# Altium schematic sheet 03-MEMORY.SchDoc
size A3
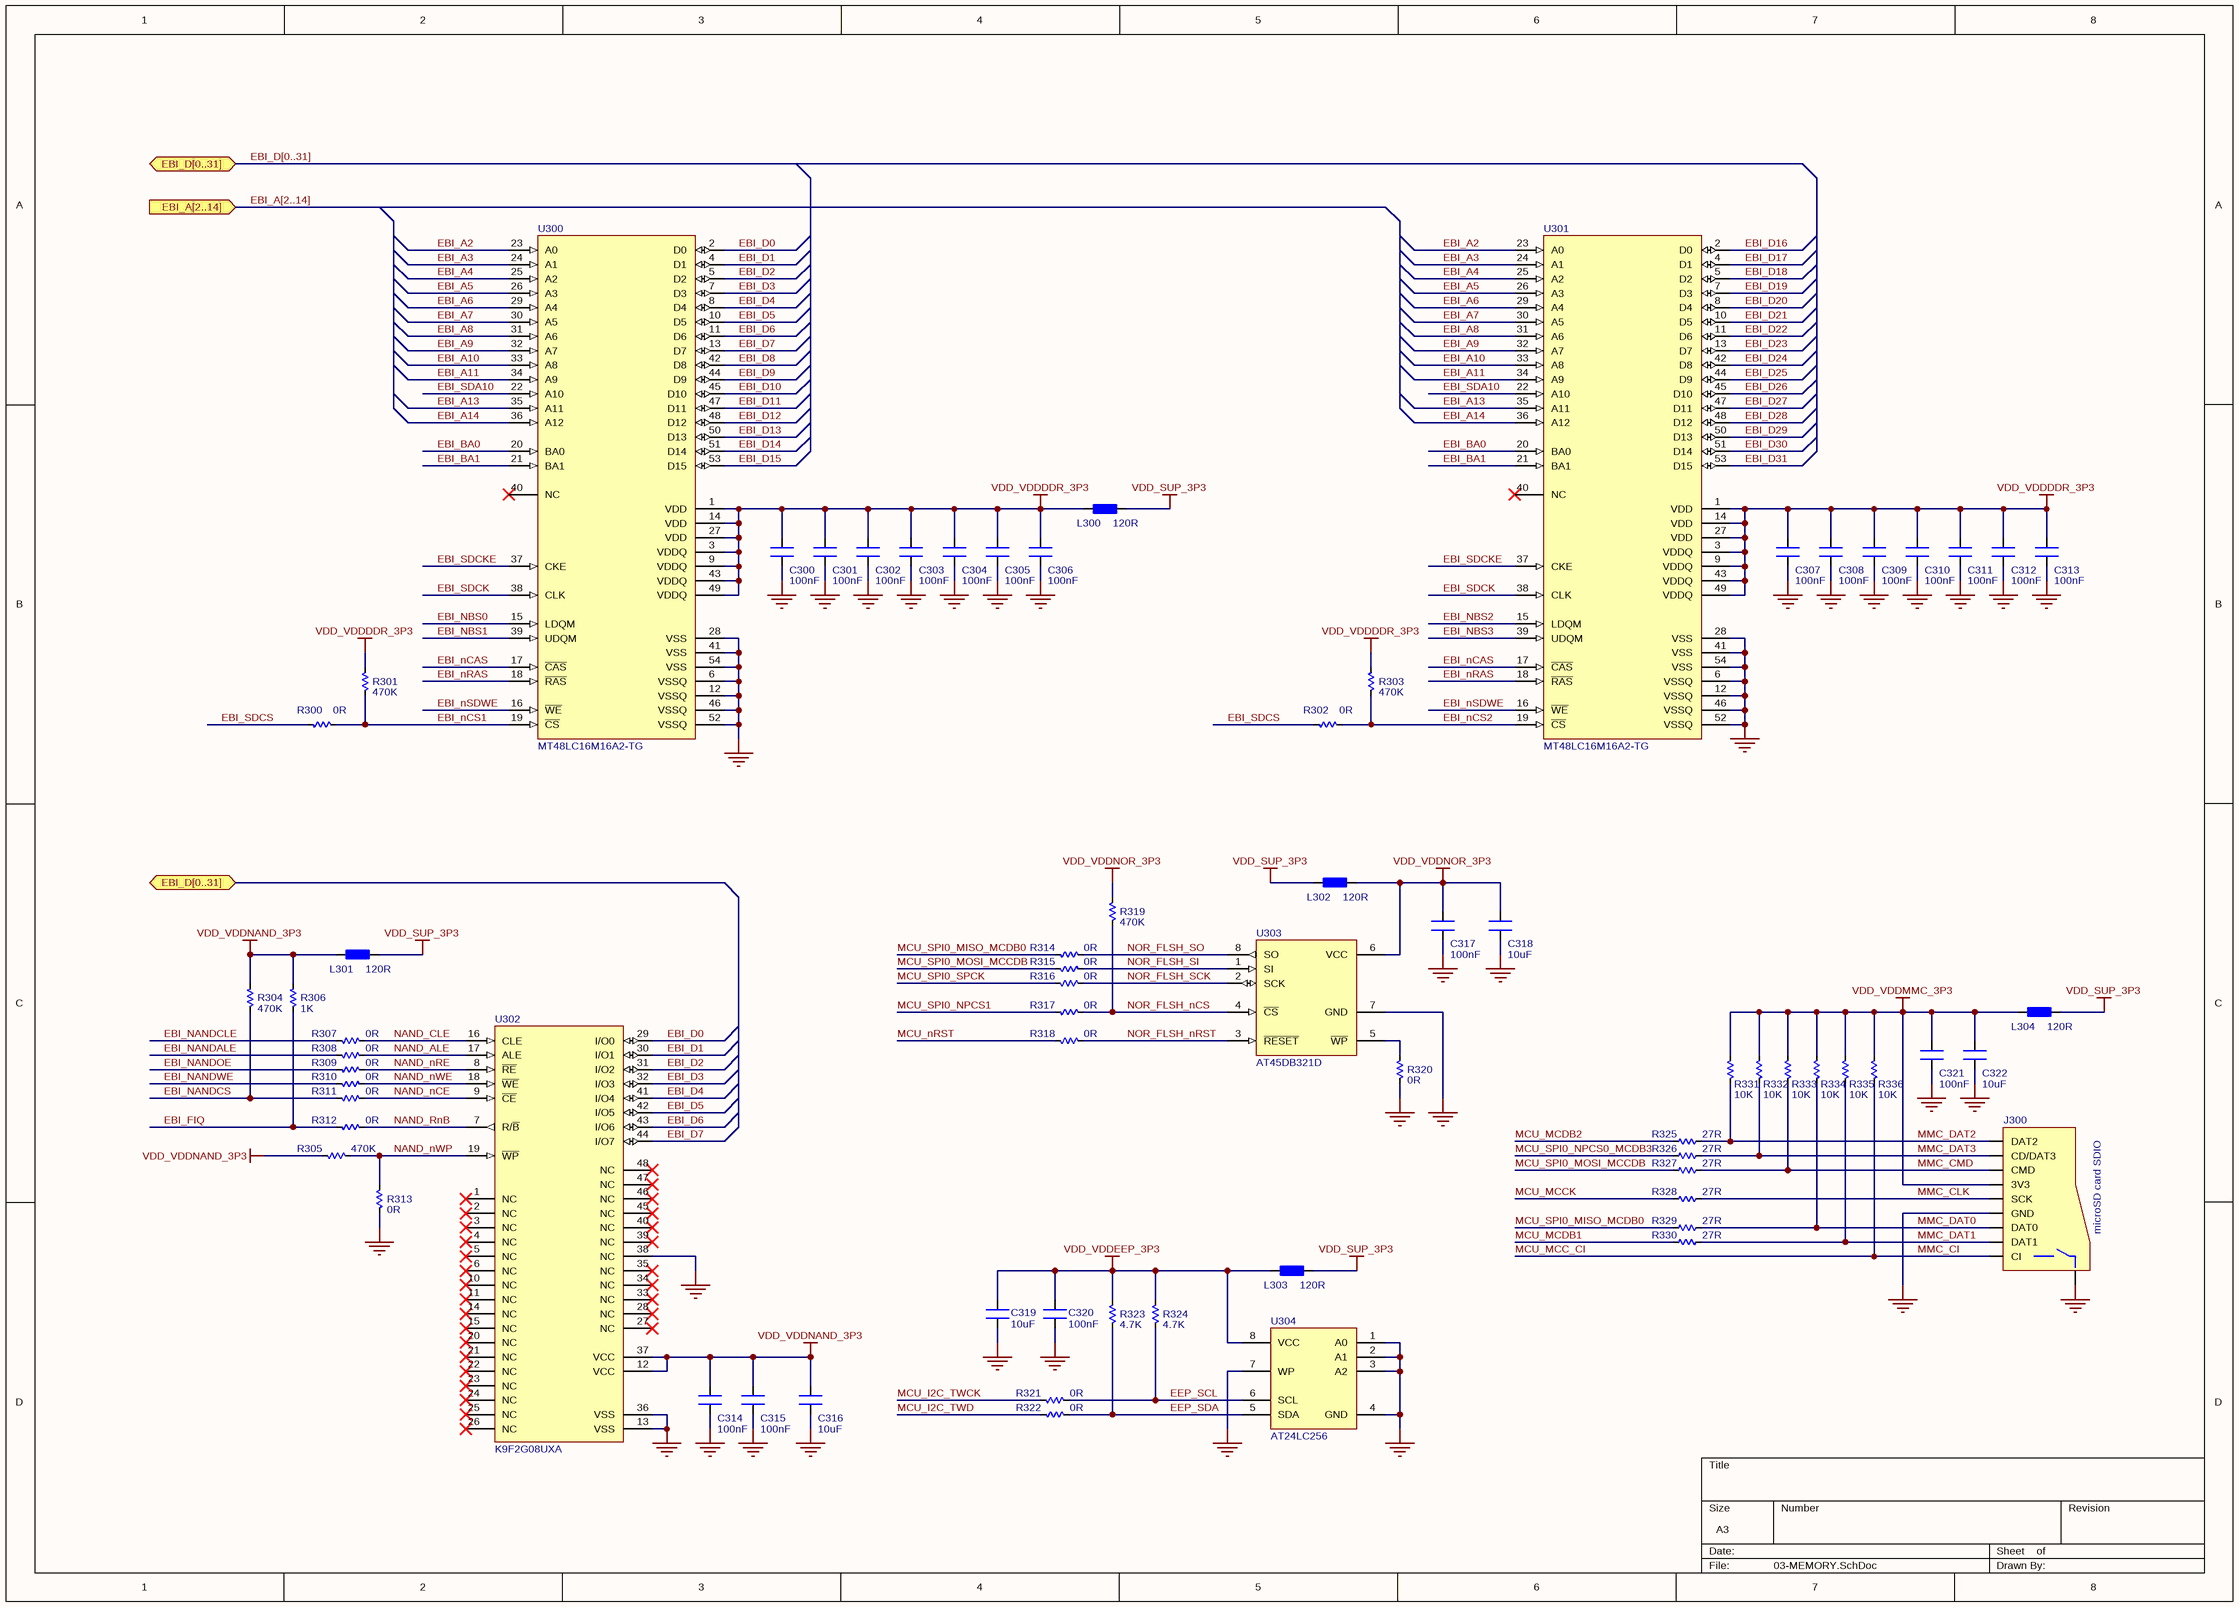
[diagram p0: 03-MEMORY.SchDoc]

## Parts
C300  value 100nF  [CN-SMD-0603]  (hidden comment: Capacitor)
C301  value 100nF  [CN-SMD-0603]  (hidden comment: Capacitor)
C302  value 100nF  [CN-SMD-0603]  (hidden comment: Capacitor)
C303  value 100nF  [CN-SMD-0603]  (hidden comment: Capacitor)
C304  value 100nF  [CN-SMD-0603]  (hidden comment: Capacitor)
C305  value 100nF  [CN-SMD-0603]  (hidden comment: Capacitor)
C306  value 100nF  [CN-SMD-0603]  (hidden comment: Capacitor)
C307  value 100nF  [CN-SMD-0603]  (hidden comment: Capacitor)
C308  value 100nF  [CN-SMD-0603]  (hidden comment: Capacitor)
C309  value 100nF  [CN-SMD-0603]  (hidden comment: Capacitor)
C310  value 100nF  [CN-SMD-0603]  (hidden comment: Capacitor)
C311  value 100nF  [CN-SMD-0603]  (hidden comment: Capacitor)
C312  value 100nF  [CN-SMD-0603]  (hidden comment: Capacitor)
C313  value 100nF  [CN-SMD-0603]  (hidden comment: Capacitor)
C314  value 100nF  [CN-SMD-0603]  (hidden comment: Capacitor)
C315  value 100nF  [CN-SMD-0603]  (hidden comment: Capacitor)
C316  value 10uF  [CN-SMD-0603]  (hidden comment: Capacitor)
C317  value 100nF  [CN-SMD-0603]  (hidden comment: Capacitor)
C318  value 10uF  [CN-SMD-0603]  (hidden comment: Capacitor)
C319  value 10uF  [CN-SMD-0603]  (hidden comment: Capacitor)
C320  value 100nF  [CN-SMD-0603]  (hidden comment: Capacitor)
C321  value 100nF  [CN-SMD-0603]  (hidden comment: Capacitor)
C322  value 10uF  [CN-SMD-0603]  (hidden comment: Capacitor)
J300  microSD card SDIO  [MICROSD1]
L300  value 120R  [L-SMD-0603]  (hidden comment: Ferrite bead)
L301  value 120R  [L-SMD-0603]  (hidden comment: Ferrite bead)
L302  value 120R  [L-SMD-0603]  (hidden comment: Ferrite bead)
L303  value 120R  [L-SMD-0603]  (hidden comment: Ferrite bead)
L304  value 120R  [L-SMD-0603]  (hidden comment: Ferrite bead)
R300  value 0R  [RES-SMD-0603]  (hidden comment: Resistor)
R301  value 470K  [RES-SMD-0603]  (hidden comment: Resistor)
R302  value 0R  [RES-SMD-0603]  (hidden comment: Resistor)
R303  value 470K  [RES-SMD-0603]  (hidden comment: Resistor)
R304  value 470K  [RES-SMD-0603]  (hidden comment: Resistor)
R305  value 470K  [RES-SMD-0603]  (hidden comment: Resistor)
R306  value 1K  [RES-SMD-0603]  (hidden comment: Resistor)
R307  value 0R  [RES-SMD-0603]  (hidden comment: Resistor)
R308  value 0R  [RES-SMD-0603]  (hidden comment: Resistor)
R309  value 0R  [RES-SMD-0603]  (hidden comment: Resistor)
R310  value 0R  [RES-SMD-0603]  (hidden comment: Resistor)
R311  value 0R  [RES-SMD-0603]  (hidden comment: Resistor)
R312  value 0R  [RES-SMD-0603]  (hidden comment: Resistor)
R313  value 0R  [RES-SMD-0603]  (hidden comment: Resistor)
R314  value 0R  [RES-SMD-0603]  (hidden comment: Resistor)
R315  value 0R  [RES-SMD-0603]  (hidden comment: Resistor)
R316  value 0R  [RES-SMD-0603]  (hidden comment: Resistor)
R317  value 0R  [RES-SMD-0603]  (hidden comment: Resistor)
R318  value 0R  [RES-SMD-0603]  (hidden comment: Resistor)
R319  value 470K  [RES-SMD-0603]  (hidden comment: Resistor)
R320  value 0R  [RES-SMD-0603]  (hidden comment: Resistor)
R321  value 0R  [RES-SMD-0603]  (hidden comment: Resistor)
R322  value 0R  [RES-SMD-0603]  (hidden comment: Resistor)
R323  value 4.7K  [RES-SMD-0603]  (hidden comment: Resistor)
R324  value 4.7K  [RES-SMD-0603]  (hidden comment: Resistor)
R325  27R  [RES-SMD-0603]
R326  27R  [RES-SMD-0603]
R327  27R  [RES-SMD-0603]
R328  27R  [RES-SMD-0603]
R329  27R  [RES-SMD-0603]
R330  27R  [RES-SMD-0603]
R331  value 10K  [RES-SMD-0603]  (hidden comment: Resistor)
R332  value 10K  [RES-SMD-0603]  (hidden comment: Resistor)
R333  value 10K  [RES-SMD-0603]  (hidden comment: Resistor)
R334  value 10K  [RES-SMD-0603]  (hidden comment: Resistor)
R335  value 10K  [RES-SMD-0603]  (hidden comment: Resistor)
R336  value 10K  [RES-SMD-0603]  (hidden comment: Resistor)
U300  MT48LC16M16A2-TG  [TSOP80P1180X120-54N]
U301  MT48LC16M16A2-TG  [TSOP80P1180X120-54N]
U302  K9F2G08UXA  [TSOP50P2000X120-48N]
U303  AT45DB321D  [SOIC127P798X216-8N]
U304  AT24LC256  [SOIC127P600X175-8N]

## Ports
EBI_A[2..14] (in), EBI_D[0..31] (bidir)

## Nets
GND: C300.1 C301.1 C302.1 C303.1 C304.1 C305.1 C306.1 C307.1 C308.1 C309.1 C310.1 C311.1 C312.1 C313.1 C314.1 C315.1 C316.1 C317.1 C318.1 C319.1 C320.1 C321.1 C322.1 J300.6(GND) J300.?1(NC) R313.2 R320.2 U300.6(VSSQ) U300.12(VSSQ) U300.28(VSS) U300.41(VSS) U300.46(VSSQ) U300.52(VSSQ) U300.54(VSS) U301.6(VSSQ) U301.12(VSSQ) U301.28(VSS) U301.41(VSS) U301.46(VSSQ) U301.52(VSSQ) U301.54(VSS) U302.13(VSS) U302.36(VSS) U302.38(NC) U303.7(GND) U304.1(A0) U304.2(A1) U304.3(A2) U304.4(GND) U304.7(WP)
VDD_SUP_3P3: L300.2 L301.2 L302.2 L303.2 L304.2
VDD_VDDDDR_3P3: C300.2 C301.2 C302.2 C303.2 C304.2 C305.2 C306.2 C307.2 C308.2 C309.2 C310.2 C311.2 C312.2 C313.2 L300.1 R301.1 R303.1 U300.1(VDD) U300.3(VDDQ) U300.9(VDDQ) U300.14(VDD) U300.27(VDD) U300.43(VDDQ) U300.49(VDDQ) U301.1(VDD) U301.3(VDDQ) U301.9(VDDQ) U301.14(VDD) U301.27(VDD) U301.43(VDDQ) U301.49(VDDQ)
VDD_VDDEEP_3P3: C319.2 C320.2 L303.1 R323.1 R324.1 U304.8(VCC)
VDD_VDDMMC_3P3: C321.2 C322.2 J300.4(3V3) L304.1 R331.1 R332.1 R333.1 R334.1 R335.1 R336.1
VDD_VDDNAND_3P3: C314.2 C315.2 C316.2 L301.1 R304.1 R305.2 R306.1 U302.12(VCC) U302.37(VCC)
VDD_VDDNOR_3P3: C317.2 C318.2 L302.1 R319.1 U303.6(VCC)
EBI_A2: U300.23(A0) U301.23(A0)
EBI_A3: U300.24(A1) U301.24(A1)
EBI_A4: U300.25(A2) U301.25(A2)
EBI_A5: U300.26(A3) U301.26(A3)
EBI_A6: U300.29(A4) U301.29(A4)
EBI_A7: U300.30(A5) U301.30(A5)
EBI_A8: U300.31(A6) U301.31(A6)
EBI_A9: U300.32(A7) U301.32(A7)
EBI_A10: U300.33(A8) U301.33(A8)
EBI_A11: U300.34(A9) U301.34(A9)
EBI_A13: U300.35(A11) U301.35(A11)
EBI_A14: U300.36(A12) U301.36(A12)
EBI_BA0: U300.20(BA0) U301.20(BA0)
EBI_BA1: U300.21(BA1) U301.21(BA1)
EBI_D0: U300.2(D0) U302.29(I/O0)
EBI_D1: U300.4(D1) U302.30(I/O1)
EBI_D2: U300.5(D2) U302.31(I/O2)
EBI_D3: U300.7(D3) U302.32(I/O3)
EBI_D4: U300.8(D4) U302.41(I/O4)
EBI_D5: U300.10(D5) U302.42(I/O5)
EBI_D6: U300.11(D6) U302.43(I/O6)
EBI_D7: U300.13(D7) U302.44(I/O7)
EBI_D8: U300.42(D8)
EBI_D9: U300.44(D9)
EBI_D10: U300.45(D10)
EBI_D11: U300.47(D11)
EBI_D12: U300.48(D12)
EBI_D13: U300.50(D13)
EBI_D14: U300.51(D14)
EBI_D15: U300.53(D15)
EBI_D16: U301.2(D0)
EBI_D17: U301.4(D1)
EBI_D18: U301.5(D2)
EBI_D19: U301.7(D3)
EBI_D20: U301.8(D4)
EBI_D21: U301.10(D5)
EBI_D22: U301.11(D6)
EBI_D23: U301.13(D7)
EBI_D24: U301.42(D8)
EBI_D25: U301.44(D9)
EBI_D26: U301.45(D10)
EBI_D27: U301.47(D11)
EBI_D28: U301.48(D12)
EBI_D29: U301.50(D13)
EBI_D30: U301.51(D14)
EBI_D31: U301.53(D15)
EBI_FIQ: R306.2 R312.2
EBI_NANDALE: R308.2
EBI_NANDCLE: R307.2
EBI_NANDCS: R304.2 R311.2
EBI_NANDOE: R309.2
EBI_NANDWE: R310.2
EBI_NBS0: U300.15(LDQM)
EBI_NBS1: U300.39(UDQM)
EBI_NBS2: U301.15(LDQM)
EBI_NBS3: U301.39(UDQM)
EBI_nCAS: U300.17(~{CAS}) U301.17(~{CAS})
EBI_nCS1: R300.1 R301.2 U300.19(~{CS})
EBI_nCS2: R302.1 R303.2 U301.19(~{CS})
EBI_nRAS: U300.18(~{RAS}) U301.18(~{RAS})
EBI_nSDWE: U300.16(~{WE}) U301.16(~{WE})
EBI_SDA10: U300.22(A10) U301.22(A10)
EBI_SDCK: U300.38(CLK) U301.38(CLK)
EBI_SDCKE: U300.37(CKE) U301.37(CKE)
EBI_SDCS: R300.2 R302.2
EEP_SCL: R321.1 R324.2 U304.6(SCL)
EEP_SDA: R322.1 R323.2 U304.5(SDA)
MCU_I2C_TWCK: R321.2
MCU_I2C_TWD: R322.2
MCU_MCC_CI: J300.9(CI) R336.2  [also labelled MMC_CI]
MCU_MCCK: R328.1
MCU_MCDB1: R330.1
MCU_MCDB2: R325.1
MCU_nRST: R318.2
MCU_SPI0_MISO_MCDB0: R314.2 R329.1
MCU_SPI0_MOSI_MCCDB: R315.2 R327.1
MCU_SPI0_NPCS0_MCDB3: R326.1
MCU_SPI0_NPCS1: R317.2
MCU_SPI0_SPCK: R316.2
MMC_CLK: J300.5(SCK) R328.2
MMC_CMD: J300.3(CMD) R327.2 R333.2
MMC_DAT0: J300.7(DAT0) R329.2 R334.2
MMC_DAT1: J300.8(DAT1) R330.2 R335.2
MMC_DAT2: J300.1(DAT2) R325.2 R331.2
MMC_DAT3: J300.2(CD/DAT3) R326.2 R332.2
NAND_ALE: R308.1 U302.17(ALE)
NAND_CLE: R307.1 U302.16(CLE)
NAND_nCE: R311.1 U302.9(~{CE})
NAND_nRE: R309.1 U302.8(~{RE})
NAND_nWE: R310.1 U302.18(~{WE})
NAND_nWP: R305.1 R313.1 U302.19(~{WP})
NAND_RnB: R312.1 U302.7(R/~{B})
NOR_FLSH_nCS: R317.1 R319.2 U303.4(~{CS})
NOR_FLSH_nRST: R318.1 U303.3(~{RESET})
NOR_FLSH_SCK: R316.1 U303.2(SCK)
NOR_FLSH_SI: R315.1 U303.1(SI)
NOR_FLSH_SO: R314.1 U303.8(SO)
NetR320_1: R320.1 U303.5(~{WP})

Not connected (* = marked no-connect by the designer): U300 40(NC)*; U301 40(NC)*; U302 1(NC)* 2(NC)* 3(NC)* 4(NC)* 5(NC)* 6(NC)* 10(NC)* 11(NC)* 14(NC)* 15(NC)* 20(NC)* 21(NC)* 22(NC)* 23(NC)* 24(NC)* 25(NC)* 26(NC)* 27(NC)* 28(NC)* 33(NC)* 34(NC)* 35(NC)* 39(NC)* 40(NC)* 45(NC)* 46(NC)* 47(NC)* 48(NC)*

## Buses and harness runs
bus EBI_A[2..14] = port EBI_A[2..14]
bus EBI_D[0..31] = port EBI_D[0..31]

## Library data of the parts
C300-C315 C317 C320 C321 = Cap: Ceramic Capacitor SMD 0603 100nF ±20% 10V
C316 C318 C319 C322 = Cap: Ceramic Capacitor SMD 0603 10uF ±20% 10V
J300 = microSD card SDIO: microSD card socket
L300-L304 = Ferrite bead: Ferrite bead SMD 0603 120 Ohm @100MHz
R300 R302 R307-R318 R320-R322 = Res: Resistor SMD 0603 0R 1% 0.1W
R301 R303-R305 R319 = Res: Resistor SMD 0603 470K 1% 0.1W
R306 = Res: Resistor SMD 0603 1K 1% 0.1W
R323 R324 = Res: Resistor SMD 0603 4.7K 1% 0.1W
R325-R330 = Res: Resistor SMD 0603 1/10W 1%; Value: 1k
R331-R336 = Res: Resistor SMD 0603 10K 1% 0.1W
U300 U301 = MT48LC16M16A2-TG: 256Mb SDRAM (16Meg x 16)
U302 = K9F2G08UXA: Samsung 256M x 8 Bit NAND Flash Memory
U303 = AT45DB321D: Adesto Technologies 32Mb, 2.5V or 2.7V serial / DataFlash
U304 = AT24C32: Atmel 256Kb 2-wire serial EEPROM